# Altium schematic sheet Poly Phase Metering.SchDoc
size A3; SheetNumber: 3; SheetTotal: 6
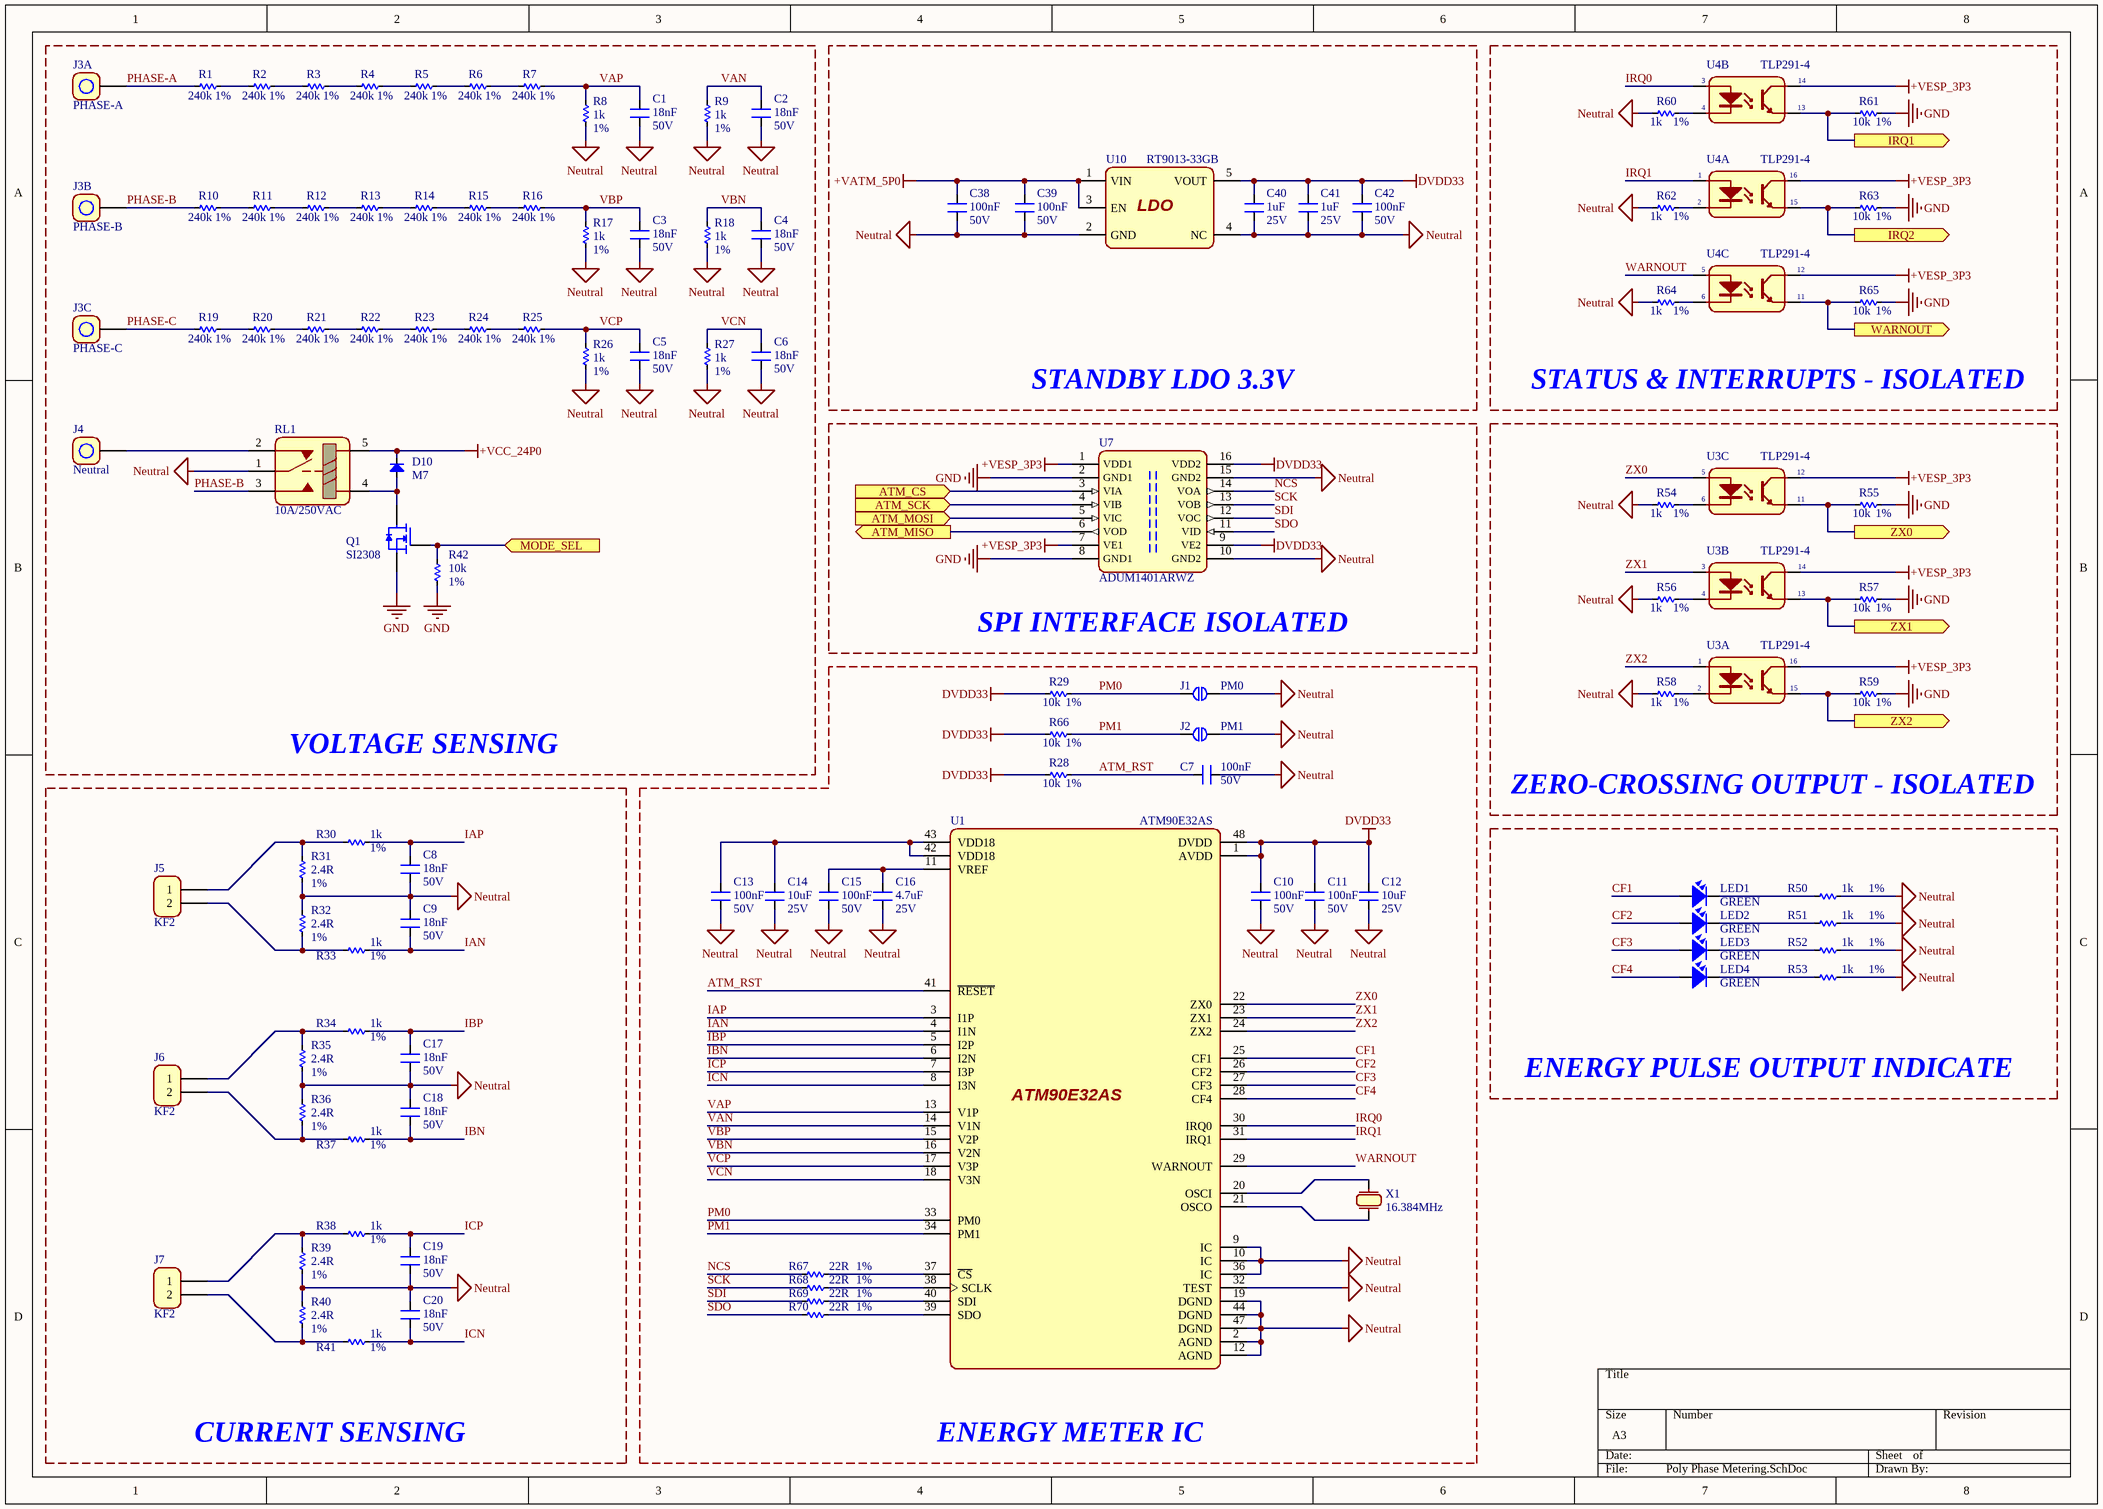
[diagram p0: Poly Phase Metering.SchDoc]

## Parts
C1  Rating: 50V  [CAP_SMD_1206]  (hidden comment: 18nF)
C2  Rating: 50V  [CAP_SMD_1206]  (hidden comment: 18nF)
C3  Rating: 50V  [CAP_SMD_1206]  (hidden comment: 18nF)
C4  Rating: 50V  [CAP_SMD_1206]  (hidden comment: 18nF)
C5  Rating: 50V  [CAP_SMD_1206]  (hidden comment: 18nF)
C6  Rating: 50V  [CAP_SMD_1206]  (hidden comment: 18nF)
C7  Rating: 50V  [CAP_SMD_0603]  (hidden comment: 100nF)
C8  Rating: 50V  [CAP_SMD_1206]  (hidden comment: 18nF)
C9  Rating: 50V  [CAP_SMD_1206]  (hidden comment: 18nF)
C10  Rating: 50V  [CAP_SMD_0603]  (hidden comment: 100nF)
C11  Rating: 50V  [CAP_SMD_0603]  (hidden comment: 100nF)
C12  Rating: 25V  [CAP_SMD_0603]  (hidden comment: 10uF)
C13  Rating: 50V  [CAP_SMD_0603]  (hidden comment: 100nF)
C14  Rating: 25V  [CAP_SMD_0603]  (hidden comment: 10uF)
C15  Rating: 50V  [CAP_SMD_0603]  (hidden comment: 100nF)
C16  Rating: 25V  [CAP_SMD_0603]  (hidden comment: 4.7uF)
C17  Rating: 50V  [CAP_SMD_1206]  (hidden comment: 18nF)
C18  Rating: 50V  [CAP_SMD_1206]  (hidden comment: 18nF)
C19  Rating: 50V  [CAP_SMD_1206]  (hidden comment: 18nF)
C20  Rating: 50V  [CAP_SMD_1206]  (hidden comment: 18nF)
C38  Rating: 50V  [CAP_SMD_0603]  (hidden comment: 100nF)
C39  Rating: 50V  [CAP_SMD_0603]  (hidden comment: 100nF)
C40  Rating: 25V  [CAP_SMD_0603]  (hidden comment: 1uF)
C41  Rating: 25V  [CAP_SMD_0603]  (hidden comment: 1uF)
C42  Rating: 50V  [CAP_SMD_0603]  (hidden comment: 100nF)
D10  M7  [DIO-SMD-A]
J1  PM0  [SOLDER_JUMP_2]
J2  PM1  [SOLDER_JUMP_2]
J3  PHASE-A  [Plugin,P=9.5mm]  (parts A,B,C of 3)
J4  Neutral  [Plugin-2,P=9.5mm]
J5  KF2  [KF2-5.08X]
J6  KF2  [KF2-5.08X]
J7  KF2  [KF2-5.08X]
LED1  GREEN  [GREENLED_0603]
LED2  GREEN  [GREENLED_0603]
LED3  GREEN  [GREENLED_0603]
LED4  GREEN  [GREENLED_0603]
Q1  SI2308  [SOT23-132]
R1  Tolerance: 1%  [RES_SMD_1206]  (hidden comment: 240k)
R2  Tolerance: 1%  [RES_SMD_1206]  (hidden comment: 240k)
R3  Tolerance: 1%  [RES_SMD_1206]  (hidden comment: 240k)
R4  Tolerance: 1%  [RES_SMD_1206]  (hidden comment: 240k)
R5  Tolerance: 1%  [RES_SMD_1206]  (hidden comment: 240k)
R6  Tolerance: 1%  [RES_SMD_1206]  (hidden comment: 240k)
R7  Tolerance: 1%  [RES_SMD_1206]  (hidden comment: 240k)
R8  Tolerance: 1%  [RES_SMD_1206]  (hidden comment: 1k)
R9  Tolerance: 1%  [RES_SMD_1206]  (hidden comment: 1k)
R10  Tolerance: 1%  [RES_SMD_1206]  (hidden comment: 240k)
R11  Tolerance: 1%  [RES_SMD_1206]  (hidden comment: 240k)
R12  Tolerance: 1%  [RES_SMD_1206]  (hidden comment: 240k)
R13  Tolerance: 1%  [RES_SMD_1206]  (hidden comment: 240k)
R14  Tolerance: 1%  [RES_SMD_1206]  (hidden comment: 240k)
R15  Tolerance: 1%  [RES_SMD_1206]  (hidden comment: 240k)
R16  Tolerance: 1%  [RES_SMD_1206]  (hidden comment: 240k)
R17  Tolerance: 1%  [RES_SMD_1206]  (hidden comment: 1k)
R18  Tolerance: 1%  [RES_SMD_1206]  (hidden comment: 1k)
R19  Tolerance: 1%  [RES_SMD_1206]  (hidden comment: 240k)
R20  Tolerance: 1%  [RES_SMD_1206]  (hidden comment: 240k)
R21  Tolerance: 1%  [RES_SMD_1206]  (hidden comment: 240k)
R22  Tolerance: 1%  [RES_SMD_1206]  (hidden comment: 240k)
R23  Tolerance: 1%  [RES_SMD_1206]  (hidden comment: 240k)
R24  Tolerance: 1%  [RES_SMD_1206]  (hidden comment: 240k)
R25  Tolerance: 1%  [RES_SMD_1206]  (hidden comment: 240k)
R26  Tolerance: 1%  [RES_SMD_1206]  (hidden comment: 1k)
R27  Tolerance: 1%  [RES_SMD_1206]  (hidden comment: 1k)
R28  Tolerance: 1%  [RES_SMD_0603]  (hidden comment: 10k)
R29  Tolerance: 1%  [RES_SMD_0603]  (hidden comment: 10k)
R30  Tolerance: 1%  [RES_SMD_1206]  (hidden comment: 1k)
R31  Tolerance: 1%  [RES_SMD_1206]  (hidden comment: 2.4R)
R32  Tolerance: 1%  [RES_SMD_1206]  (hidden comment: 2.4R)
R33  Tolerance: 1%  [RES_SMD_1206]  (hidden comment: 1k)
R34  Tolerance: 1%  [RES_SMD_1206]  (hidden comment: 1k)
R35  Tolerance: 1%  [RES_SMD_1206]  (hidden comment: 2.4R)
R36  Tolerance: 1%  [RES_SMD_1206]  (hidden comment: 2.4R)
R37  Tolerance: 1%  [RES_SMD_1206]  (hidden comment: 1k)
R38  Tolerance: 1%  [RES_SMD_1206]  (hidden comment: 1k)
R39  Tolerance: 1%  [RES_SMD_1206]  (hidden comment: 2.4R)
R40  Tolerance: 1%  [RES_SMD_1206]  (hidden comment: 2.4R)
R41  Tolerance: 1%  [RES_SMD_1206]  (hidden comment: 1k)
R42  Tolerance: 1%  [RES_SMD_0603]  (hidden comment: 10k)
R50  Tolerance: 1%  [RES_SMD_0603]  (hidden comment: 1k)
R51  Tolerance: 1%  [RES_SMD_0603]  (hidden comment: 1k)
R52  Tolerance: 1%  [RES_SMD_0603]  (hidden comment: 1k)
R53  Tolerance: 1%  [RES_SMD_0603]  (hidden comment: 1k)
R54  Tolerance: 1%  [RES_SMD_0603]  (hidden comment: 1k)
R55  Tolerance: 1%  [RES_SMD_0603]  (hidden comment: 10k)
R56  Tolerance: 1%  [RES_SMD_0603]  (hidden comment: 1k)
R57  Tolerance: 1%  [RES_SMD_0603]  (hidden comment: 10k)
R58  Tolerance: 1%  [RES_SMD_0603]  (hidden comment: 1k)
R59  Tolerance: 1%  [RES_SMD_0603]  (hidden comment: 10k)
R60  Tolerance: 1%  [RES_SMD_0603]  (hidden comment: 1k)
R61  Tolerance: 1%  [RES_SMD_0603]  (hidden comment: 10k)
R62  Tolerance: 1%  [RES_SMD_0603]  (hidden comment: 1k)
R63  Tolerance: 1%  [RES_SMD_0603]  (hidden comment: 10k)
R64  Tolerance: 1%  [RES_SMD_0603]  (hidden comment: 1k)
R65  Tolerance: 1%  [RES_SMD_0603]  (hidden comment: 10k)
R66  Tolerance: 1%  [RES_SMD_0603]  (hidden comment: 10k)
R67  Tolerance: 1%  [RES_SMD_0603]  (hidden comment: 22R)
R68  Tolerance: 1%  [RES_SMD_0603]  (hidden comment: 22R)
R69  Tolerance: 1%  [RES_SMD_0603]  (hidden comment: 22R)
R70  Tolerance: 1%  [RES_SMD_0603]  (hidden comment: 22R)
RL1  10A/250VAC  [SRA-05VDC-CL]
U1  ATM90E32AS  [TQFP48]
U3  TLP291-4  [SOP-16-4.4mm]  (parts A,B,C of 4)
U4  TLP291-4  [SOP-16-4.4mm]  (parts A,B,C of 4)
U7  ADUM1401ARWZ  [SOIC-16-300mil]
U10  RT9013-33GB  [SOT23-5]
X1  16.384MHz  [XT2-SMD]

## Blocks framed on the sheet
VOLTAGE SENSING: C1-C6 D10 J3 J4 Q1 R1-R27 R42 RL1
STANDBY LDO 3.3V: C38-C42 U10
STATUS & INTERRUPTS - ISOLATED: R60-R65 U4
SPI INTERFACE ISOLATED: U7
ZERO-CROSSING OUTPUT - ISOLATED: R54-R59 U3
ENERGY METER IC: C7 C10-C16 J1 J2 R28 R29 R66-R70 U1 X1
CURRENT SENSING: C8 C9 C17-C20 J5-J7 R30-R41
ENERGY PULSE OUTPUT INDICATE: LED1-LED4 R50-R53

## Ports
ATM_CS (in, see Architecture[4A]), ATM_MISO (out, see Architecture[4A]), ATM_MOSI (in, see Architecture[4A]), ATM_SCK (in, see Architecture[4A]), IRQ1 (out, see Architecture[4B]), IRQ2 (out, see Architecture[4B]), MODE_SEL (in, see Architecture[4A]), WARNOUT (out, see Architecture[4B]), ZX0 (out, see Architecture[4B]), ZX1 (out, see Architecture[4B]), ZX2 (out, see Architecture[4B])

## Nets
+VATM_5P0: C38.2 C39.2 U10.1(VIN) U10.3(EN)
+VCC_24P0: D10.2(K) RL1.5
+VESP_3P3: U3.12(C) U3.14(C) U3.16(C) U4.12(C) U4.14(C) U4.16(C) U7.1(VDD1) U7.7(VE1)
DVDD33: C10.2 C11.2 C12.2 C40.2 C41.2 C42.2 R28.1 R29.1 R66.1 U1.1(AVDD) U1.48(DVDD) U7.9(VE2) U7.16(VDD2) U10.5(VOUT)
GND: Q1.2 R42.2 R55.2 R57.2 R59.2 R61.2 R63.2 R65.2 U7.2(GND1) U7.8(GND1)
Neutral: C1.1 C2.1 C3.1 C4.1 C5.1 C6.1 C7.1 C8.1 C9.2 C10.1 C11.1 C12.1 C13.1 C14.1 C15.1 C16.1 C17.1 C18.2 C19.1 C20.2 C38.1 C39.1 C40.1 C41.1 C42.1 J1.2 J2.2 R8.2 R9.2 R17.2 R18.2 R26.2 R27.2 R31.2 R32.1 R35.2 R36.1 R39.2 R40.1 R50.2 R51.2 R52.2 R53.2 R54.1 R56.1 R58.1 R60.1 R62.1 R64.1 RL1.1 U1.2(AGND) U1.9(IC) U1.10(IC) U1.12(AGND) U1.19(DGND) U1.32(TEST) U1.36(IC) U1.44(DGND) U1.47(DGND) U7.10(GND2) U7.15(GND2) U10.2(GND) U10.4(NC)
ATM_CS: U7.3(VIA) ; port ATM_CS
ATM_MISO: U7.6(VOD) ; port ATM_MISO
ATM_MOSI: U7.5(VIC) ; port ATM_MOSI
ATM_RST: C7.2 R28.2 U1.41(~{RESET})
ATM_SCK: U7.4(VIB) ; port ATM_SCK
CF1: LED1.1 U1.25(CF1)
CF2: LED2.1 U1.26(CF2)
CF3: LED3.1 U1.27(CF3)
CF4: LED4.1 U1.28(CF4)
IAN: C9.1 R33.1 U1.4(I1N)
IAP: C8.2 R30.1 U1.3(I1P)
IBN: C18.1 R37.1 U1.6(I2N)
IBP: C17.2 R34.1 U1.5(I2P)
ICN: C20.1 R41.1 U1.8(I3N)
ICP: C19.2 R38.1 U1.7(I3P)
IRQ0: U1.30(IRQ0) U4.3(A)
IRQ1: R61.1 U4.13(E) ; port IRQ1
IRQ1: U1.31(IRQ1) U4.1(A)  [a separate net that carries the same name]
IRQ2: R63.1 U4.15(E) ; port IRQ2
MODE_SEL: Q1.1 R42.1 ; port MODE_SEL
NCS: R67.1 U7.14(VOA)
PHASE-A: J3.1(PHASE_A) R1.2
PHASE-B: J3.2(PHASE_A) R10.2 RL1.3
PHASE-C: J3.3(PHASE_A) R19.2
PM0: J1.1 R29.2 U1.33(PM0)
PM1: J2.1 R66.2 U1.34(PM1)
SCK: R68.1 U7.13(VOB)
SDI: R69.1 U7.12(VOC)
SDO: R70.1 U7.11(VID)
VAN: C2.2 R9.1 U1.14(V1N)
VAP: C1.2 R7.1 R8.1 U1.13(V1P)
VBN: C4.2 R18.1 U1.16(V2N)
VBP: C3.2 R16.1 R17.1 U1.15(V2P)
VCN: C6.2 R27.1 U1.18(V3N)
VCP: C5.2 R25.1 R26.1 U1.17(V3P)
WARNOUT: R65.1 U4.11(E) ; port WARNOUT
WARNOUT: U1.29(WARNOUT) U4.5(A)  [a separate net that carries the same name]
ZX0: R55.1 U3.11(E) ; port ZX0
ZX0: U1.22(ZX0) U3.5(A)  [a separate net that carries the same name]
ZX1: R57.1 U3.13(E) ; port ZX1
ZX1: U1.23(ZX1) U3.3(A)  [a separate net that carries the same name]
ZX2: R59.1 U3.15(E) ; port ZX2
ZX2: U1.24(ZX2) U3.1(A)  [a separate net that carries the same name]
NetC13_2: C13.2 C14.2 U1.42(VDD18) U1.43(VDD18)
NetC15_2: C15.2 C16.2 U1.11(VREF)
NetD10_1: D10.1(A) Q1.3 RL1.4
NetJ4_1, 2: J4.1,_2(PHASE_A) RL1.2
NetJ5_1: J5.1 R30.2 R31.1
NetJ5_2: J5.2 R32.2 R33.2
NetJ6_1: J6.1 R34.2 R35.1
NetJ6_2: J6.2 R36.2 R37.2
NetJ7_1: J7.1 R38.2 R39.1
NetJ7_2: J7.2 R40.2 R41.2
NetLED1_2: LED1.2 R50.1
NetLED2_2: LED2.2 R51.1
NetLED3_2: LED3.2 R52.1
NetLED4_2: LED4.2 R53.1
NetR1_1: R1.1 R2.2
NetR2_1: R2.1 R3.2
NetR3_1: R3.1 R4.2
NetR4_1: R4.1 R5.2
NetR5_1: R5.1 R6.2
NetR6_1: R6.1 R7.2
NetR10_1: R10.1 R11.2
NetR11_1: R11.1 R12.2
NetR12_1: R12.1 R13.2
NetR13_1: R13.1 R14.2
NetR14_1: R14.1 R15.2
NetR15_1: R15.1 R16.2
NetR19_1: R19.1 R20.2
NetR20_1: R20.1 R21.2
NetR21_1: R21.1 R22.2
NetR22_1: R22.1 R23.2
NetR23_1: R23.1 R24.2
NetR24_1: R24.1 R25.2
NetR54_2: R54.2 U3.6(K)
NetR56_2: R56.2 U3.4(K)
NetR58_2: R58.2 U3.2(K)
NetR60_2: R60.2 U4.4(K)
NetR62_2: R62.2 U4.2(K)
NetR64_2: R64.2 U4.6(K)
NetR67_2: R67.2 U1.37(~{CS})
NetR68_2: R68.2 U1.38(SCLK)
NetR69_2: R69.2 U1.40(SDI)
NetR70_2: R70.2 U1.39(SDO)
NetU1_20: U1.20(OSCI) X1.2
NetU1_21: U1.21(OSCO) X1.1

## Notes on the sheet
- (in symbol RT9013) LDO

## Library data of the parts
C1-C20 C38-C42 = CN: PN: *; LCSC: *
  C1-C6 C8 C9 C17-C20: Value: 18nF
  C7 C10 C11 C13 C15 C38 C39 C42: Value: 100nF
  C12 C14: Value: 10uF
  C16: Value: 4.7uF
  C40 C41: Value: 1uF
D10 = Diode SMD: Default Diode; LCSC: *; PN: *; Value: M7
J1 J2 = CNT: DNP; PN: DNP; LCSC: DNP
  J1: Value: PM0
  J2: Value: PM1
J3 = HB9500-3: Value: PHASE-A
J4 = HB9500-2: Value: Neutral
J5-J7 = KF2: ComponentLink1 Description: Manufacturer; ComponentLink2 Description: Datasheet; Manufacturer: *; ComponentLink1URL: http://www.we-online.com; ComponentLink2URL: http://katalog.we-online.de/em/datasheet/6911031100xx.pdf; LCSC: *; PN: *; Value: KF2
LED1-LED4 = LED SMD: PN: *; LCSC: *; Value: GREEN
Q1 = FET-N: PN: *; LCSC: *; Value: SI2308
R1-R42 R50-R70 = Res-SMD: Resistor; PN: *; LCSC: *
  R1-R7 R10-R16 R19-R25: Value: 240k
  R8 R9 R17 R18 R26 R27 R30 R33 R34 R37 R38 R41 R50-R54 R56 R58 R60 R62 R64: Value: 1k
  R28 R29 R42 R55 R57 R59 R61 R63 R65 R66: Value: 10k
  R31 R32 R35 R36 R39 R40: Value: 2.4R
  R67-R70: Value: 22R
RL1 = Relay 5: Relay SPDT,10A - 12VDC 5 Pin; PN: SRA-05VDC-CL; LCSC: C99666; Value: 10A/250VAC
U1 = ATM90E32AS: PN: ATM90E32AS-AU-R; LCSC: C177153; Value: ATM90E32AS
U3 U4 = TLP291-4: -55℃~+110℃ 1.2V 170mW 2.5kV 2us 3us 4 400% 400mV@2.4mA,8mA 50% 50mA 50mA 5V 80V DC Phototransistor SOP-16-4.4mm Transistor, Photovoltaic Output Optoisolators ROHS; PN: TLP291-4(GB-TP,E); LCSC: C60900; Value: TLP291-4
U7 = ADUM1401: -40℃~+125℃ 1 100ns 1Mbps 2.7V~5.5V 2.7V~5.5V 2500 25kV/us 3 SOIC-16-300mil Digital Isolators ROHS; PN: ADUM1401ARWZ; LCSC: C579384; Value: ADUM1401ARWZ
U10 = RT9013: -40℃~+125℃@(Tj) 1 25uA 3.3V 30uVrms 400mV@(500mA) 5.5V 500mA 50dB@(10kHz) Fixed Over Current Protection、Over Temperature Protection、Enable Positive SOT-23-5 Voltage Regulators - Linear, Low Drop Out (LDO) Regulators ROHS; PN: RT9013-33GB; LCSC: C47773; Value: RT9013-33GB
X1 = XT2: LCSC: *; PN: *; Value: 16.384MHz